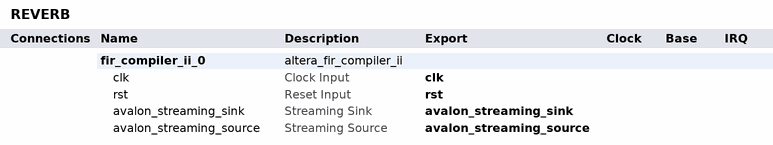
[diagram p0: system contents]
# Platform Designer (Qsys) system REVERB, MAX 10 10M50DAF484C7G
# Parameters at their usual value, and those the tool derives, are not listed.
package require -exact qsys 20.1
create_system REVERB
set_project_property DEVICE_FAMILY {MAX 10}
set_project_property DEVICE 10M50DAF484C7G

add_instance fir_compiler_ii_0 altera_fir_compiler_ii 20.1
set_instance_property fir_compiler_ii_0 AUTO_EXPORT true
set_instance_parameter_value fir_compiler_ii_0 coeffBitWidth 32
set_instance_parameter_value fir_compiler_ii_0 coeffFracBitWidth 16
set_instance_parameter_value fir_compiler_ii_0 coeffReload false
set_instance_parameter_value fir_compiler_ii_0 coeffScaling none
set_instance_parameter_value fir_compiler_ii_0 coeffType frac
set_instance_parameter_value fir_compiler_ii_0 delayRAMBlockThreshold 40
set_instance_parameter_value fir_compiler_ii_0 inputBitWidth 16
set_instance_parameter_value fir_compiler_ii_0 inputChannelNum 1
set_instance_parameter_value fir_compiler_ii_0 inputFracBitWidth 0
set_instance_parameter_value fir_compiler_ii_0 inputRate 0.044
set_instance_parameter_value fir_compiler_ii_0 inputType int
set_instance_parameter_value fir_compiler_ii_0 outLsbBitRem 0
set_instance_parameter_value fir_compiler_ii_0 outMsbBitRem 0
set_instance_parameter_value fir_compiler_ii_0 outType int
set_instance_parameter_value fir_compiler_ii_0 readWriteMode read_write
set_instance_parameter_value fir_compiler_ii_0 speedGrade fast

# exported interfaces
add_interface avalon_streaming_sink avalon_streaming sink
set_interface_property avalon_streaming_sink EXPORT_OF fir_compiler_ii_0.avalon_streaming_sink
add_interface avalon_streaming_source avalon_streaming source
set_interface_property avalon_streaming_source EXPORT_OF fir_compiler_ii_0.avalon_streaming_source
add_interface clk clock sink
set_interface_property clk EXPORT_OF fir_compiler_ii_0.clk
add_interface rst reset sink
set_interface_property rst EXPORT_OF fir_compiler_ii_0.rst

set_interconnect_requirement {$system} qsys_mm.clockCrossingAdapter HANDSHAKE
set_interconnect_requirement {$system} qsys_mm.enableEccProtection FALSE
set_interconnect_requirement {$system} qsys_mm.insertDefaultSlave FALSE
set_interconnect_requirement {$system} qsys_mm.maxAdditionalLatency 1

save_system REVERB.qsys
